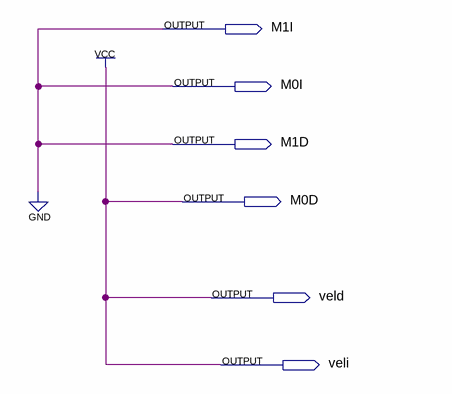
[diagram p0: schematic sheet]
// Quartus schematic prueba_motores.bdf as structural Verilog: 0 symbols, 6 pins
module prueba_motores (
  output M1I,
  output M0I,
  output M1D,
  output M0D,
  output veld,
  output veli
);


  assign M0D = 1'b1;
  assign M0I = 1'b0;
  assign M1D = 1'b0;
  assign M1I = 1'b0;
  assign veld = 1'b1;
  assign veli = 1'b1;
endmodule
